# Altium project asib.PrjPcb
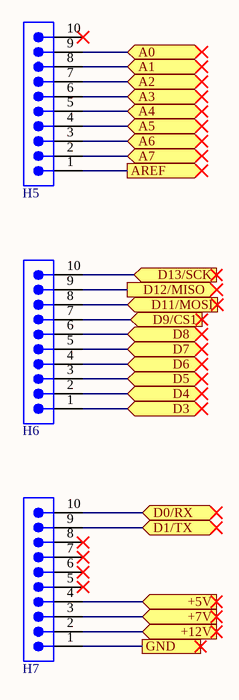
[diagram p0: asib.SchDoc]
1 sheet, 3 parts. Net scope: flat (ports and power ports of the same name join across sheets).
Board file: asib.PcbDoc

## Sheet asib.SchDoc
size A; SheetNumber: 1; SheetTotal: 1

### Parts
H5  61301011121  [61301011121]  (value not drawn)
H6  61301011121  [61301011121]  (value not drawn)
H7  61301011121  [61301011121]  (value not drawn)

### Ports
+5V (in), +7V (in), +12V (in), A0 (bidir), A1 (bidir), A2 (bidir), A3 (bidir), A4 (bidir), A5 (bidir), A6 (bidir), A7 (bidir), AREF (out), D0/RX (bidir), D1/TX (bidir), D3 (bidir), D4 (bidir), D5 (bidir), D6 (bidir), D7 (bidir), D8 (bidir), D9/CS1 (in), D11/MOSI (in), D12/MISO (out), D13/SCK (in), GND

### Nets
NetH5_1: H5.1 ; port AREF
NetH5_2: H5.2 ; port A7
NetH5_3: H5.3 ; port A6
NetH5_4: H5.4 ; port A5
NetH5_5: H5.5 ; port A4
NetH5_6: H5.6 ; port A3
NetH5_7: H5.7 ; port A2
NetH5_8: H5.8 ; port A1
NetH5_9: H5.9 ; port A0
NetH6_1: H6.1 ; port D3
NetH6_2: H6.2 ; port D4
NetH6_3: H6.3 ; port D5
NetH6_4: H6.4 ; port D6
NetH6_5: H6.5 ; port D7
NetH6_6: H6.6 ; port D8
NetH6_7: H6.7 ; port D9/CS1
NetH6_8: H6.8 ; port D11/MOSI
NetH6_9: H6.9 ; port D12/MISO
NetH6_10: H6.10 ; port D13/SCK
NetH7_1: H7.1 ; port GND
NetH7_2: H7.2 ; port +12V
NetH7_3: H7.3 ; port +7V
NetH7_4: H7.4 ; port +5V
NetH7_9: H7.9 ; port D1/TX
NetH7_10: H7.10 ; port D0/RX

Not connected (* = marked no-connect by the designer): H5 10*; H7 5* 6* 7* 8*

### Library data of the parts
H5-H7 = 61301011121: WR-PHD Pin Header, THT, Vertical, pitch 2.54mm, 1 Row, 10P; Manufacturer: Wurth Elektronik; Contact Resistance: 20mOhm; Rated Current: 3A; Working Voltage: 250V; Withstanding Voltage: 500V; Manufacturer Part Number: 61301011121; Category: Board-to-Board Connectors; Match Code: WR-PHD; ComponentLink1Description: Website Link; ComponentLink1URL: https://www.we-online.com/redexpert/article/61301011121?ad; ComponentLink2Description: Datasheet Link; ComponentLink2URL: https://www.we-online.com/redexpert/spec/61301011121?ad; Mount: Through Hole; Operating Temperature Max: 105°C; Operating Temperature Min: -40°C; Packaging: Bag; Gender: Pin Header; Number of Pins: 10; Number of Rows: 1; Orientation: Vertical; Pitch: 2.54mm